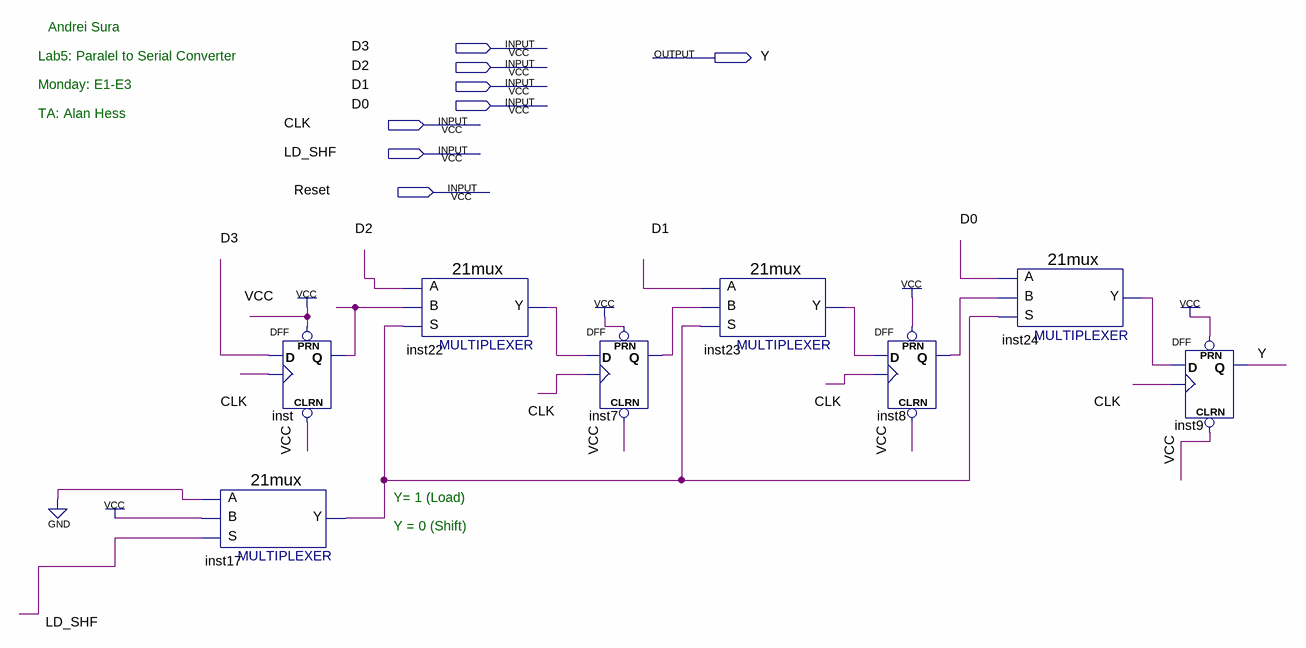
[diagram p0: schematic sheet]
// Quartus schematic lab5_serial_para_conv.bdf as structural Verilog: 8 symbols, 8 pins
module lab5_serial_para_conv (
  input  D3,
  input  D2,
  input  D1,
  input  D0,
  input  CLK,
  input  LD_SHF,
  input  Reset,
  output Y
);

  wire inst7_q, inst8_q, inst17_y, inst22_y, inst23_y, inst24_y, inst_q;

  \21mux  inst17 (.S(LD_SHF), .B(1'b1), .A(1'b0), .Y(inst17_y));
  DFF inst (.CLRN(1'b1), .CLK(CLK), .D(D3), .PRN(1'b1), .Q(inst_q));
  \21mux  inst22 (.S(inst17_y), .B(inst_q), .A(D2), .Y(inst22_y));
  DFF inst7 (.CLRN(1'b1), .CLK(CLK), .D(inst22_y), .PRN(1'b1), .Q(inst7_q));
  \21mux  inst23 (.S(inst17_y), .B(inst7_q), .A(D1), .Y(inst23_y));
  DFF inst8 (.CLRN(1'b1), .CLK(CLK), .D(inst23_y), .PRN(1'b1), .Q(inst8_q));
  \21mux  inst24 (.S(inst17_y), .B(inst8_q), .A(D0), .Y(inst24_y));
  DFF inst9 (.CLRN(1'b1), .CLK(CLK), .D(inst24_y), .PRN(1'b1), .Q(Y));

  // Notes on the sheet:
  //   Andrei Sura
  //   Lab5: Paralel to Serial Converter
  //   Monday: E1-E3
  //   TA: Alan Hess
  //   Y= 1 (Load)
  //   Y = 0 (Shift)
endmodule
